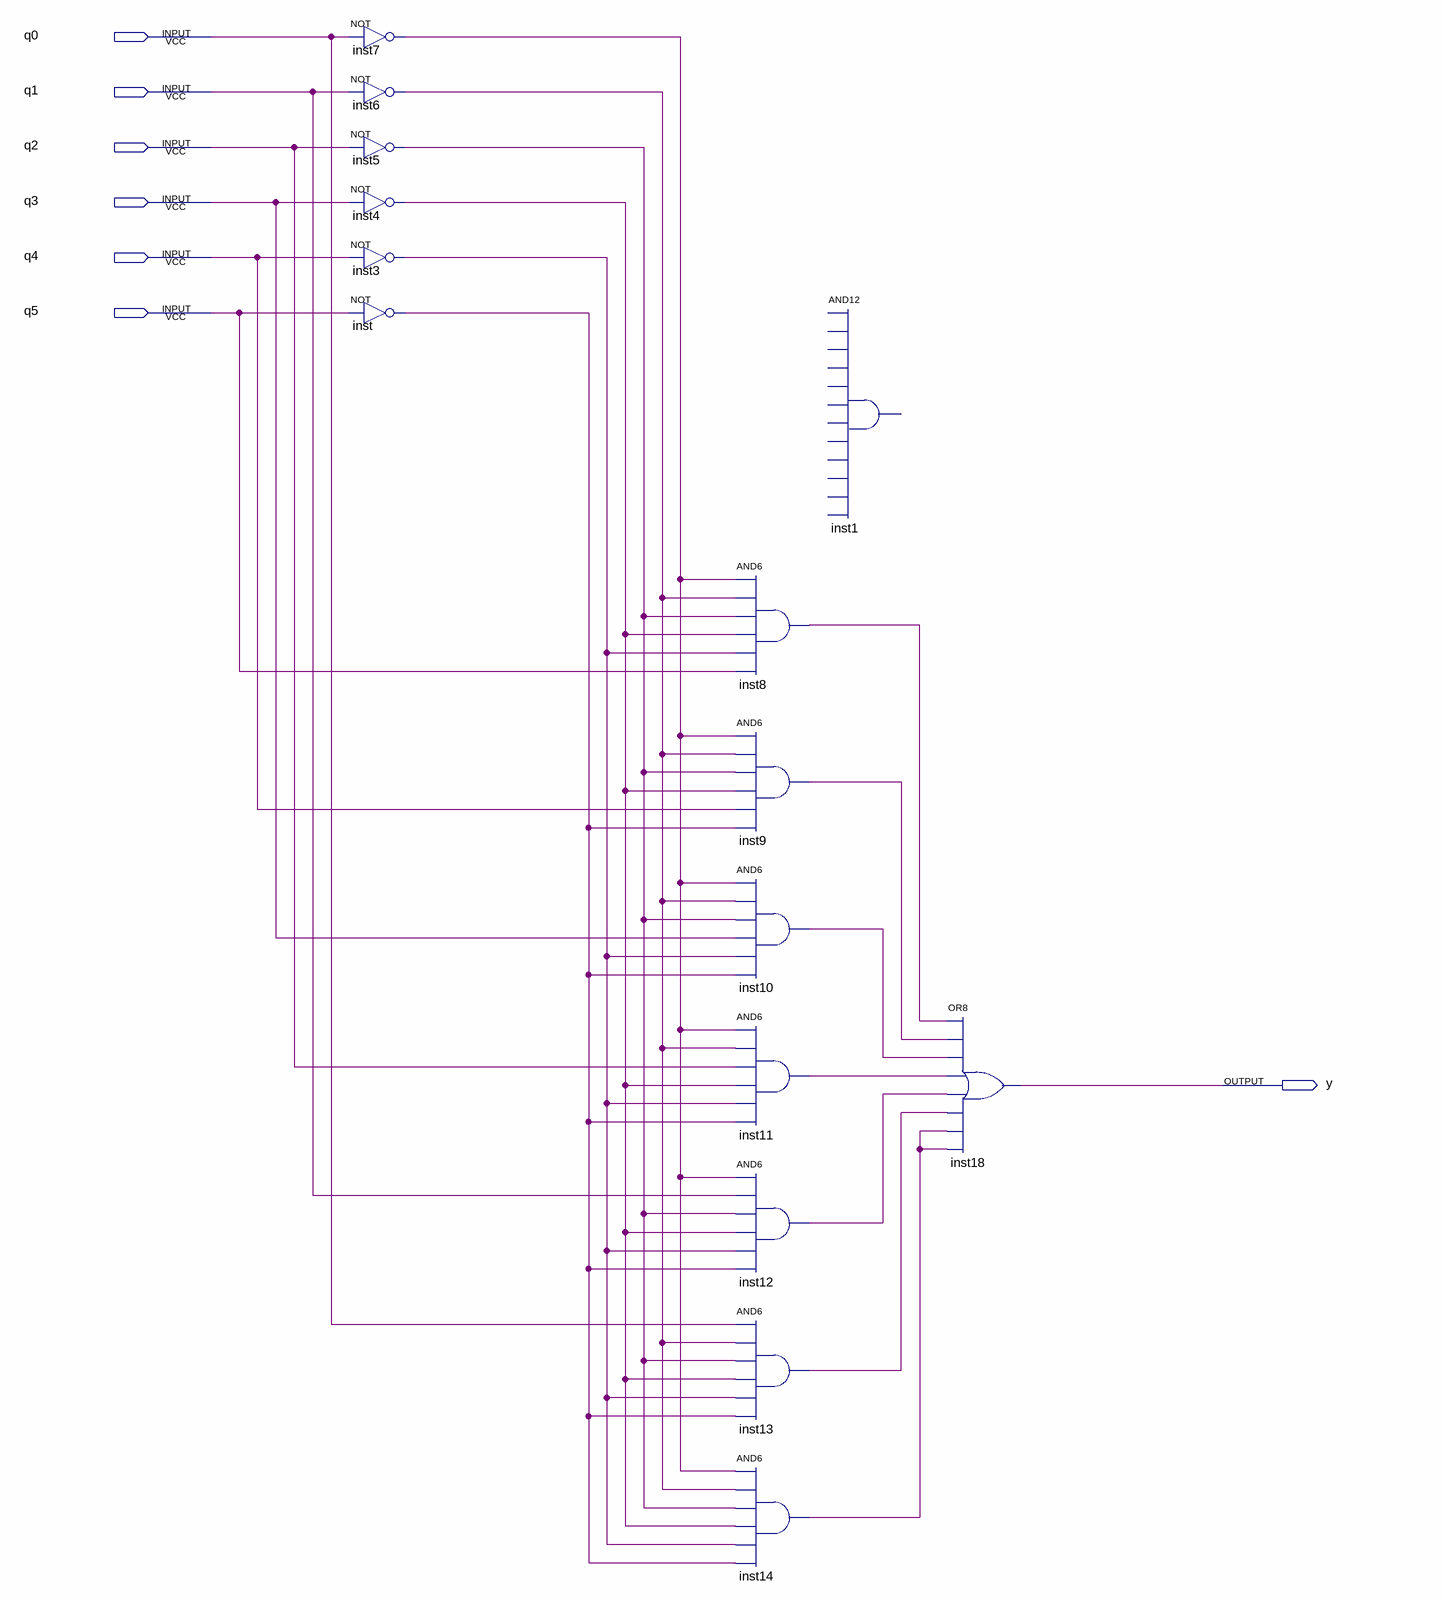
[diagram p0: schematic sheet]
// Quartus schematic error_test.bdf as structural Verilog: 15 symbols, 7 pins
module error_test (
  input  q0,
  input  q1,
  input  q2,
  input  q3,
  input  q4,
  input  q5,
  output y
);

  wire inst3_out, inst4_out, inst5_out, inst6_out, inst7_out, inst8_out, inst9_out, inst10_out, inst11_out,
       inst12_out, inst13_out, inst14_out, inst_out;

  not inst7 (inst7_out, q0);
  not inst6 (inst6_out, q1);
  not inst5 (inst5_out, q2);
  not inst4 (inst4_out, q3);
  not inst3 (inst3_out, q4);
  not inst (inst_out, q5);
  and inst8 (inst8_out, inst7_out, inst6_out, inst5_out, inst4_out, inst3_out, q5);
  and inst9 (inst9_out, inst7_out, inst6_out, inst5_out, inst4_out, q4, inst_out);
  and inst10 (inst10_out, inst7_out, inst6_out, inst5_out, q3, inst3_out, inst_out);
  and inst11 (inst11_out, inst7_out, inst6_out, q2, inst4_out, inst3_out, inst_out);
  and inst12 (inst12_out, inst7_out, q1, inst5_out, inst4_out, inst3_out, inst_out);
  and inst13 (inst13_out, q0, inst6_out, inst5_out, inst4_out, inst3_out, inst_out);
  and inst14 (inst14_out, inst7_out, inst6_out, inst5_out, inst4_out, inst3_out, inst_out);
  // AND12 inst1 is placed but not wired
  or inst18 (y, inst8_out, inst9_out, inst10_out, inst11_out, inst12_out, inst13_out, inst14_out, inst14_out);
endmodule
